# EAGLE design DualStepper (EAGLE 7.7.0)
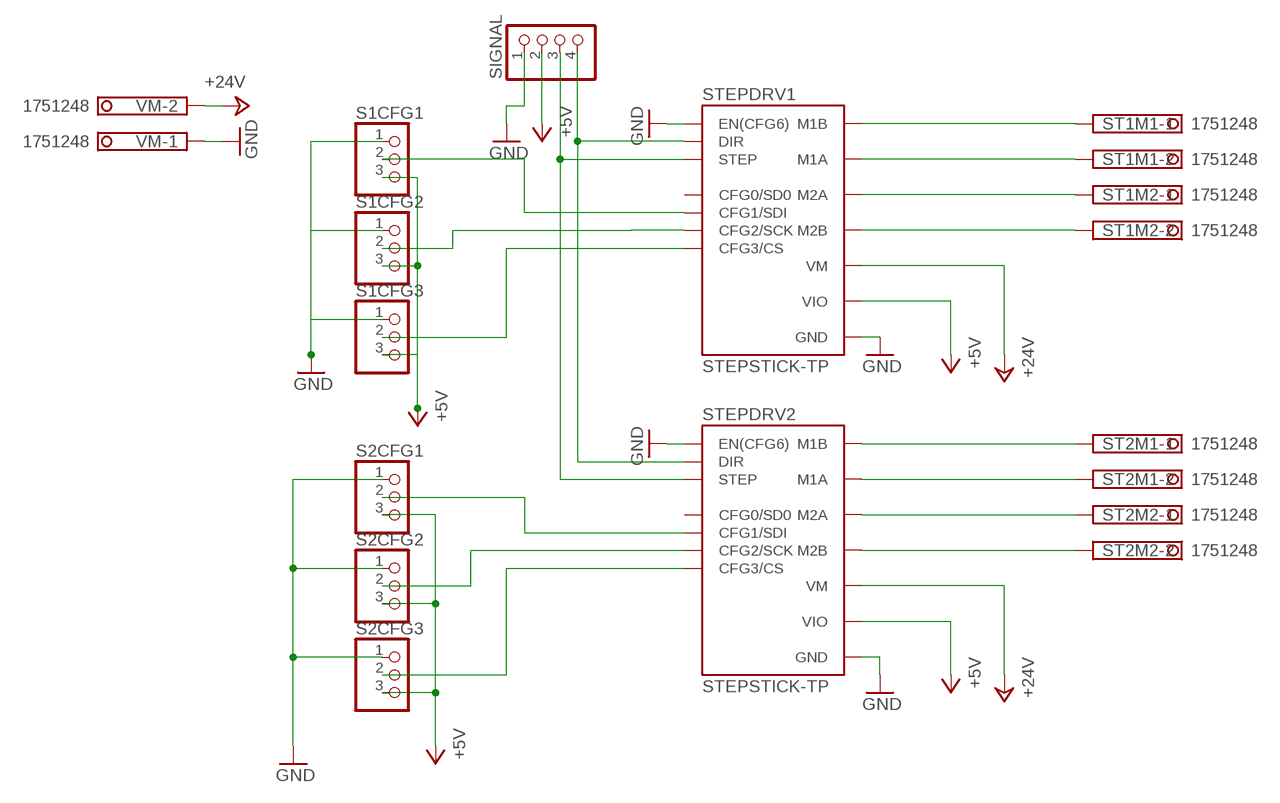
[diagram p0: schematic, sheet 1]

## Parts
S1CFG1  PINHD-1X3  [1X03]
S1CFG2  PINHD-1X3  [1X03]
S1CFG3  PINHD-1X3  [1X03]
S2CFG1  PINHD-1X3  [1X03]
S2CFG2  PINHD-1X3  [1X03]
S2CFG3  PINHD-1X3  [1X03]
SIGNAL  PINHD-1X4  [1X04]
ST1M1  1751248  [1751248]
ST1M2  1751248  [1751248]
ST2M1  1751248  [1751248]
ST2M2  1751248  [1751248]
STEPDRV1  STEPSTICK-TP  [STEPSTICK_TP]
STEPDRV2  STEPSTICK-TP  [STEPSTICK_TP]
VM  1751248  [1751248]

## Nets
+5V: S1CFG1.3 S1CFG2.3 S1CFG3.3 S2CFG1.3 S2CFG2.3 S2CFG3.3 SIGNAL.2 STEPDRV1.VIO STEPDRV2.VIO
+24V: STEPDRV1.VM STEPDRV2.VM VM.2
GND: S1CFG1.1 S1CFG2.1 S1CFG3.1 S2CFG1.1 S2CFG2.1 S2CFG3.1 SIGNAL.1 STEPDRV1.EN(EN(CFG6)) STEPDRV1.GND@1(GND) STEPDRV1.GND@2(GND) STEPDRV2.EN(EN(CFG6)) STEPDRV2.GND@1(GND) STEPDRV2.GND@2(GND) VM.1
N$1: ST1M2.2 STEPDRV1.M2B
N$2: ST1M2.1 STEPDRV1.M2A
N$3: ST1M1.2 STEPDRV1.M1A
N$4: ST1M1.1 STEPDRV1.M1B
N$5: ST2M1.1 STEPDRV2.M1B
N$6: ST2M1.2 STEPDRV2.M1A
N$7: ST2M2.1 STEPDRV2.M2A
N$8: ST2M2.2 STEPDRV2.M2B
N$9: S2CFG1.2 STEPDRV2.CFG1(CFG1/SDI)
N$10: S2CFG2.2 STEPDRV2.CFG2(CFG2/SCK)
N$11: S2CFG3.2 STEPDRV2.CFG3(CFG3/CS)
N$12: S1CFG2.2 STEPDRV1.CFG2(CFG2/SCK)
N$13: S1CFG3.2 STEPDRV1.CFG3(CFG3/CS)
N$14: S1CFG1.2 STEPDRV1.CFG1(CFG1/SDI)
N$15: SIGNAL.4 STEPDRV1.DIR STEPDRV2.DIR
N$16: SIGNAL.3 STEPDRV1.STEP STEPDRV2.STEP
Unconnected: STEPDRV1.NC(CFG0/SD0) STEPDRV1.NC/CFG0(CFG0/SD0) STEPDRV2.NC(CFG0/SD0) STEPDRV2.NC/CFG0(CFG0/SD0)

## Library data of the parts
S1CFG1-S1CFG3 S2CFG1-S2CFG3 = pinhead:PINHD-1X3: PIN HEADER
SIGNAL = pinhead:PINHD-1X4: PIN HEADER
ST1M1 ST1M2 ST2M1 ST2M2 VM = con-phoenix-350:1751248: MKDS 1/ 2-3,5 Printklemme Nennstrom: 10 A Bemessungsspannung: 160 V Raster: 3,5 mm Polzahl: 2 Montageart: Löten Anschlussart: Schraubanschluss Anschlussrichtung vom Leiter zur Platine: 0° Source: http://eshop.phoenixcontact.com .. 1751248.pdf; OC_FARNELL: unknown; OC_NEWARK: unknown
STEPDRV1 STEPDRV2 = we-board:STEPSTICK: SilentStepStick - Trinamic TMC2100/TMC2130 Stepper Motor Driver TMC2100 - CFG pins for configuration TMC2130 - SPI for configuration Pin CFG0/SDO only available on TMC2130 SilentStepStick.

## Net classes
1 pwr: width 0.813 mm

## Board
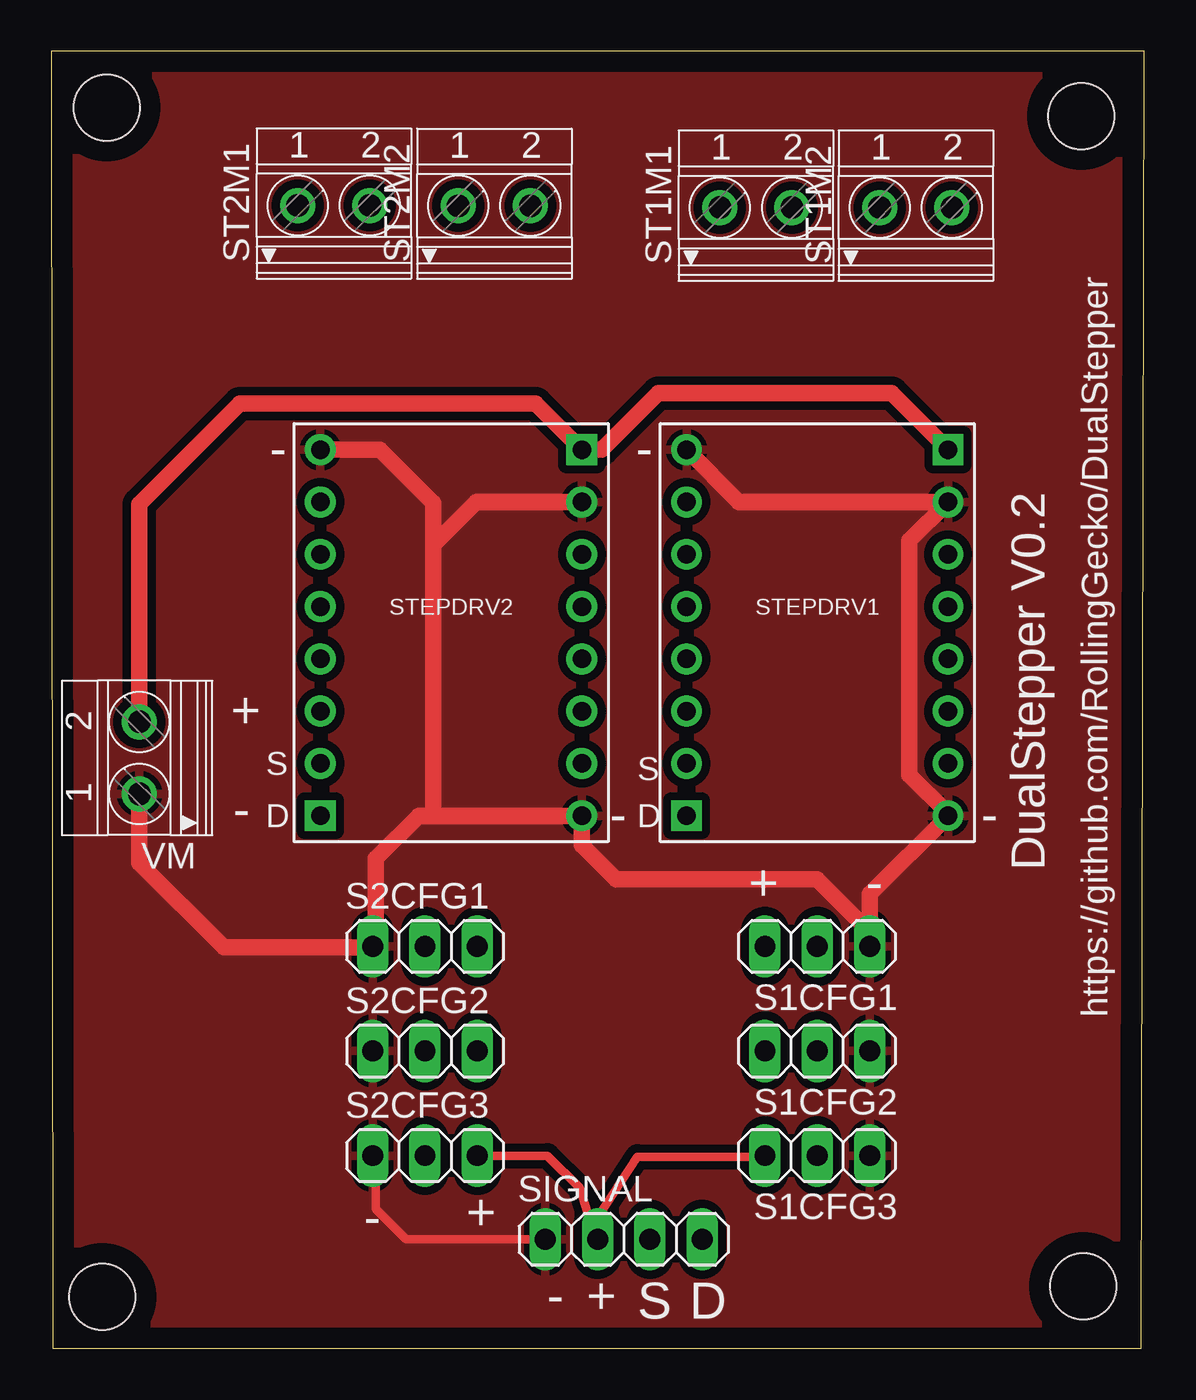
[diagram p1: board, top side]
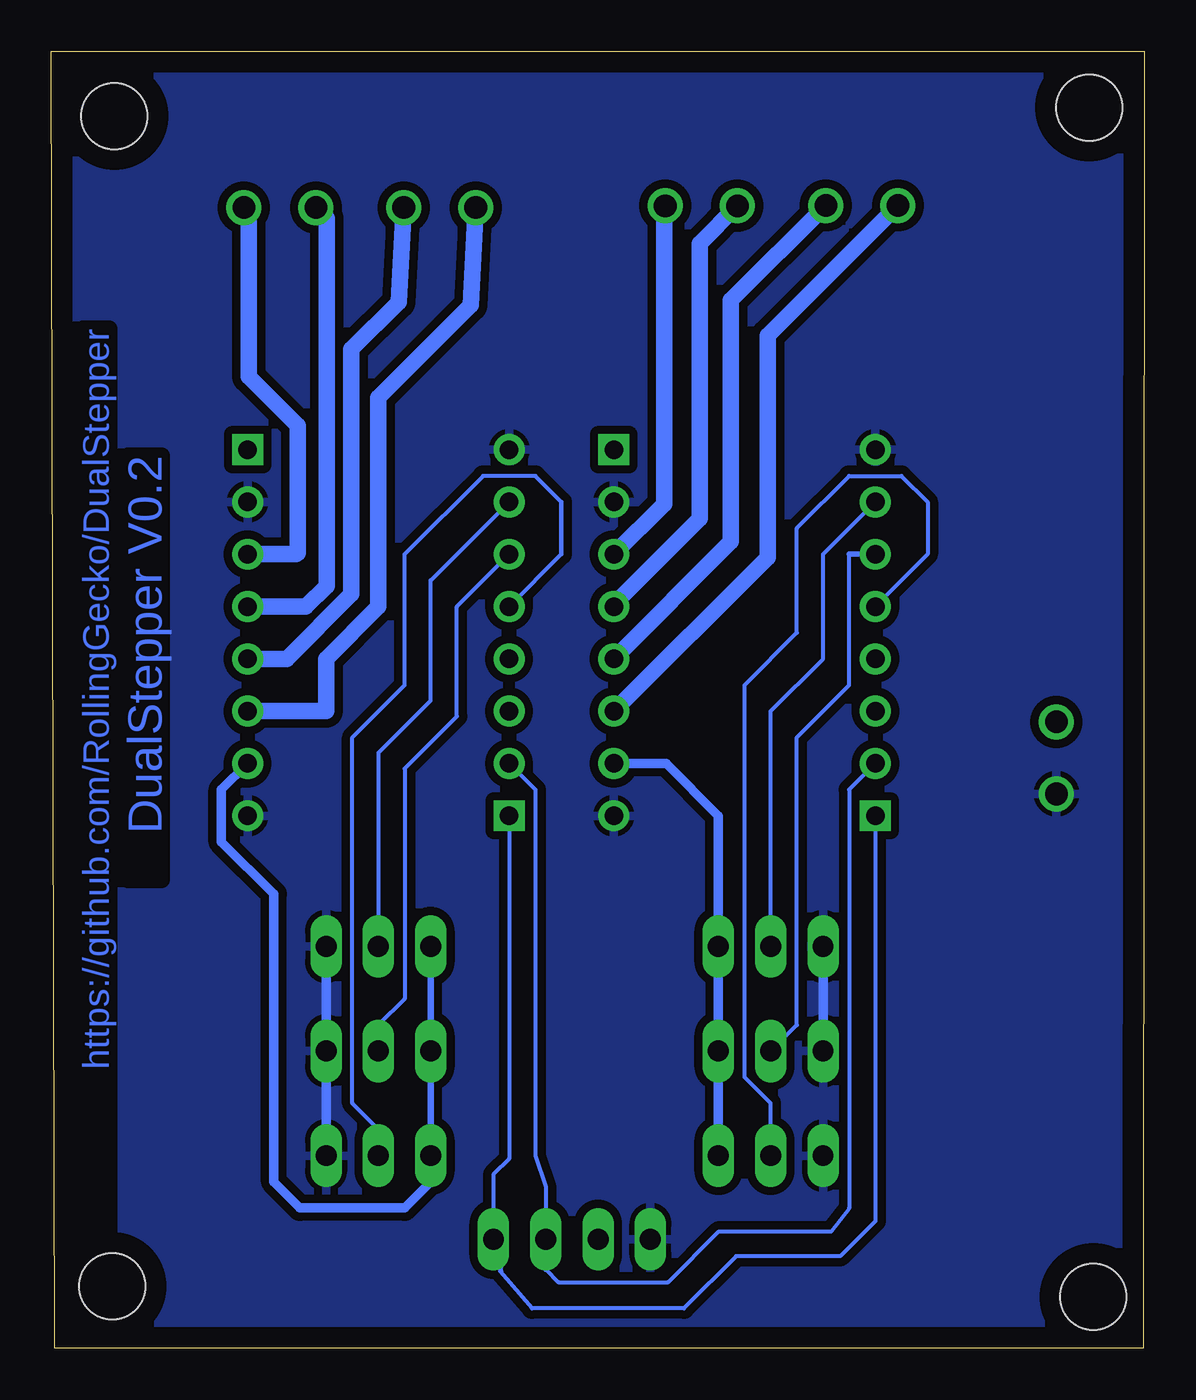
[diagram p2: board, bottom side, seen from below]

Size 53.06 x 62.98 mm. Coordinates in mm from the lower left corner, seen from the top.
Outline: 0.05,0 52.91,0 53.06,62.98 0,62.98 0.05,0
Copper layers (1*16): Top 0.035mm / dielectric 1.5mm / Bottom 0.035mm
Design rules "default *": minimum track width 7mil, minimum drill 24mil, track to track 10mil, track to pad 10mil, pad to pad 10mil, via to via 10mil, smd to smd 10mil, copper to edge 40mil, drill to drill 8mil, minimum pad ring 10mil, minimum via ring 8mil, stop-mask expansion 4mil, vias tented up to drill 0mil, thermal gap 10mil
Holes 3.2 mm at 2.46,2.48 50.1,3 2.67,60.26 50.01,59.85

### Footprints (pad centres in the part's own frame; a part is rotated, then mirrored left to right if it is on the bottom)
1X03 = drill 1.016 long: 1 -2.54,0; 2 0,0; 3 2.54,0
1X04 = drill 1.016 long: 1 -3.81,0; 2 -1.27,0; 3 1.27,0; 4 3.81,0
1751248 = drill 1.1 pad 1.7: 1 -1.75,-0.1; 2 1.75,-0.1
STEPSTICK_TP = drill 0.9 pad 1.5: CFG1 -6.35,6.35; CFG2 -6.35,3.81; CFG3 -6.35,1.27; EN -6.35,8.89; GND@1 6.35,6.35; GND@2 6.35,-8.89; M1A 6.35,-1.27; M1B 6.35,-3.81; M2A 6.35,1.27; M2B 6.35,3.81; NC -6.35,-3.81; NC/CFG0 -6.35,-1.27; STEP -6.35,-6.35; VIO 6.35,-6.35 | drill 0.9 pad 1.5 square: DIR -6.35,-8.89; VM 6.35,8.89

### Placement (x,y rotation side)
S1CFG1  37.19,19.51 180 top
S1CFG2  37.19,14.43 180 top
S1CFG3  37.19,9.35 180 top
S2CFG1  18.14,19.51 0 top
S2CFG2  18.14,14.43 0 top
S2CFG3  18.14,9.35 0 top
SIGNAL  27.79,5.28 0 top
ST1M1  34.21,55.5 0 top
ST1M2  41.97,55.5 0 top
ST2M1  13.71,55.6 0 top
ST2M2  21.51,55.59 0 top
STEPDRV1  37.19,34.75 0 top
STEPDRV2  19.41,34.75 0 top
VM  4.17,28.67 90 top

### Tracks (layer width: path | path; a pad name or v marks a point on that pad's centre or on a via)
+5V
  Top 0.406: S1CFG3.3 34.59,9.3 28.45,9.3 26.52,6.35 SIGNAL.2 26.42,5.38 25.65,7.77 24.08,9.35 S2CFG3.3
  Bottom 0.305: S1CFG3.3 S1CFG2.3 S1CFG1.3
  Bottom 0.457: S1CFG3.3 34.65,8.08 35.92,6.81 41,6.81 42.27,8.08 42.27,22.05 44.81,24.59 44.81,27.13 STEPDRV1.VIO | STEPDRV2.VIO 23.22,28.4 20.68,25.86 S2CFG1.3 S2CFG2.3 S2CFG3.3
+24V
  Top 0.813: VM.2 4.27,41 9.14,45.87 23.52,45.87 STEPDRV2.VM 26.72,43.64 29.46,46.38 40.79,46.38 STEPDRV1.VM
GND
  Top 0.406: SIGNAL.1 17.22,5.28 15.75,6.76 15.75,9.19 S2CFG3.1
  Top 0.813: VM.1 4.27,23.57 8.38,19.46 15.55,19.46 S2CFG1.1 15.75,19.66 15.75,23.77 17.83,25.86 18.54,25.86 | 18.54,25.86 STEPDRV2.GND@2 25.76,24.43 27.43,22.76 37.19,22.76 39.73,20.22 | 39.73,20.22 S1CFG1.1 | 39.73,20.22 39.73,22.05 STEPDRV1.GND@2 43.54,25.96 41.66,27.84 41.66,39.22 STEPDRV1.GND@1 33.38,41.1 STEPDRV1.EN | STEPDRV2.EN 15.95,43.64 18.54,41.05 18.54,39.01 | 18.54,39.01 18.54,25.86 | STEPDRV2.GND@1 20.62,41.1 18.54,39.01
  Bottom 0.457: S1CFG1.1 S1CFG2.1 S1CFG3.1 | S2CFG1.1 S2CFG2.1
  pour Top (isolate 0.406): 0,62.89 52.83,62.89 52.83,1.68 52.83,-0.1 8.64,-0.1 0,-0.1
  pour Bottom (isolate 0.406): 0,62.89 52.83,62.89 52.83,20.22 52.83,-0.1 11.94,-0.1 0.25,-0.1 0.25,62.64
N$1
  Bottom 0.813: STEPDRV1.M2B 41.17,38.56 41.11,38.62 41.11,44.81 43.48,47.19 43.48,55.16 ST1M2.2
N$2
  Bottom 0.813: STEPDRV1.M2A 40.71,36.02 39.71,37.02 39.71,54.88 ST1M2.1
N$3
  Bottom 0.813: STEPDRV1.M1A 41.65,33.48 38.51,36.62 38.51,48.51 36.21,50.81 ST1M1.2
N$4
  Bottom 0.813: STEPDRV1.M1B 39.73,30.94 39.73,33.48 37.19,36.02 37.19,46.18 32.71,50.65 ST1M1.1
N$5
  Bottom 0.813: ST2M1.1 18.29,49.17 18.29,38.4 STEPDRV2.M1B
N$6
  Bottom 0.813: ST2M1.2 20.07,50.89 20.07,39.17 STEPDRV2.M1A
N$7
  Bottom 0.813: ST2M2.1 21.59,53.65 21.59,40.28 25.76,36.12 STEPDRV2.M2A
N$8
  Bottom 0.813: STEPDRV2.M2B 23.32,41 23.32,55.42 ST2M2.2
N$9
  Bottom 0.2: S2CFG1.2 18.14,30.94 15.6,33.48 15.6,38.56 STEPDRV2.CFG1
N$10
  Bottom 0.2: S2CFG2.2 16.87,15.7 16.87,29.67 14.33,32.21 14.33,38.56
  Bottom 0.257: 14.33,38.56 STEPDRV2.CFG2
N$11
  Bottom 0.2: S2CFG3.2 18.14,11.89 19.41,13.16 19.41,32.21 16.87,34.75 16.87,39.83 14.33,42.37 11.79,42.37 10.52,41.1 10.52,38.56 STEPDRV2.CFG3
N$12
  Bottom 0.2: S1CFG2.2 37.19,15.7 35.92,16.97 35.92,28.14 33.38,30.68 33.38,36.02 STEPDRV1.CFG2
N$13
  Bottom 0.2: S1CFG3.2 37.19,10.62 38.46,11.89 38.46,29.67 35.92,32.21 35.92,38.56 32.11,42.37 29.57,42.37 28.3,41.1 | STEPDRV1.CFG3 28.3,38.56
  Bottom 0.22: 28.3,38.56 28.3,41.1
N$14
  Bottom 0.2: STEPDRV1.CFG1 34.65,37.29 34.65,31.45 37.19,28.91 S1CFG1.2
N$15
  Bottom 0.2: STEPDRV2.DIR 13.06,6.17
  Bottom 0.203: 13.06,6.17 14.76,4.46 19.82,4.46 22.35,1.93 29.72,1.93 31.24,3.71 | STEPDRV1.DIR 30.84,9.19 31.6,8.43 SIGNAL.4
  Bottom 0.254: 31.24,3.71 31.24,4.93 SIGNAL.4
  Bottom 0.457: 31.67,5.21 SIGNAL.4
N$16
  Bottom 0.2: STEPDRV2.STEP 14.33,27.13 14.33,6.8 15.21,5.66 | STEPDRV1.STEP 29.57,27.13 29.57,9.35 29.06,7.82 SIGNAL.3 29.06,4.75
  Bottom 0.203: 29.07,3.82 28.45,3.2 23.11,3.2 20.65,5.66 15.21,5.66
  Bottom 0.254: 29.07,4.74 29.07,3.82
  Bottom 0.457: 29.07,4.74 29.06,4.75
N$17
  Top 0.406: 15.75,9.3 15.49,9.3

### Text on the board
Bottom: https://github.com/RollingGecko/DualStepper | DualStepper V0.2
tNames: https://github.com/RollingGecko/DualStepper | - | - | DualStepper V0.2 | + | S | S | - | D | - | D | - | + | - | - | + | - | + | S | D